# Altium project TK90X.PrjPcb
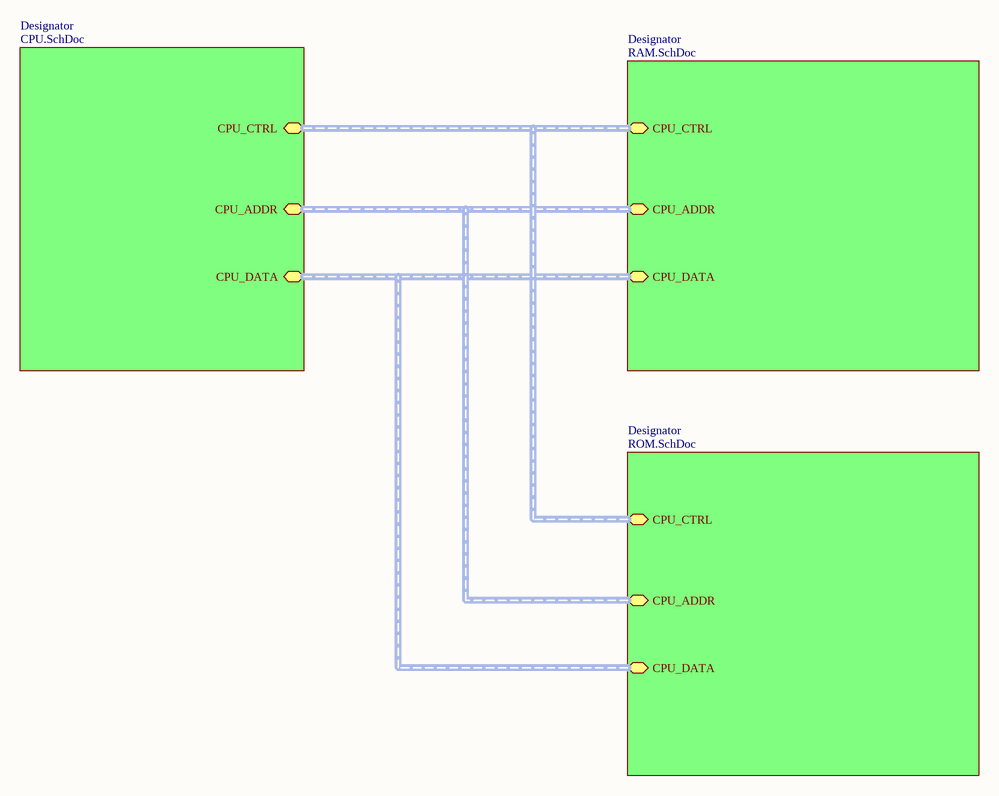
[diagram p0: TK90X.SchDoc]
8 sheets, 78 parts. Net scope: hierarchical (ports join the sheet entries above them; power ports are global).
Sheets:
  TK90X.SchDoc
    Designator = CPU.SchDoc
    Designator = RAM.SchDoc
    Designator = ROM.SchDoc
  ULA.SchDoc
  VRAM.SchDoc
  Power.SchDoc
  VGA.SchDoc

## Sheet TK90X.SchDoc
size A3

### Sub-sheets
Designator = CPU.SchDoc: CPU_CTRL (harness CPU_CTRL), CPU_ADDR (harness CPU_ADDR), CPU_DATA (harness CPU_DATA)
Designator = RAM.SchDoc: CPU_CTRL (harness CPU_CTRL), CPU_ADDR (harness CPU_ADDR), CPU_DATA (harness CPU_DATA)
Designator = ROM.SchDoc: CPU_CTRL (harness CPU_CTRL), CPU_ADDR (harness CPU_ADDR), CPU_DATA (harness CPU_DATA)

## Sheet CPU.SchDoc
size A3; PageSetup: Record=PageOptions|CenterHorizontal=True|CenterVertical=True|PrintScale=1.04|XCorrection=1.00|YCorrection=1.00|PrintKind=0|BorderSize=5000000|LeftOffset=0|BottomOffset=0|Orientation=2|PaperLength=1000|PaperWidth=1000|Scale=100|PaperSource=7|PrintQuality=-3|MediaType=1|DitherType=10|PrintScaleMode=1|PaperKind=A3|PaperIndex=8
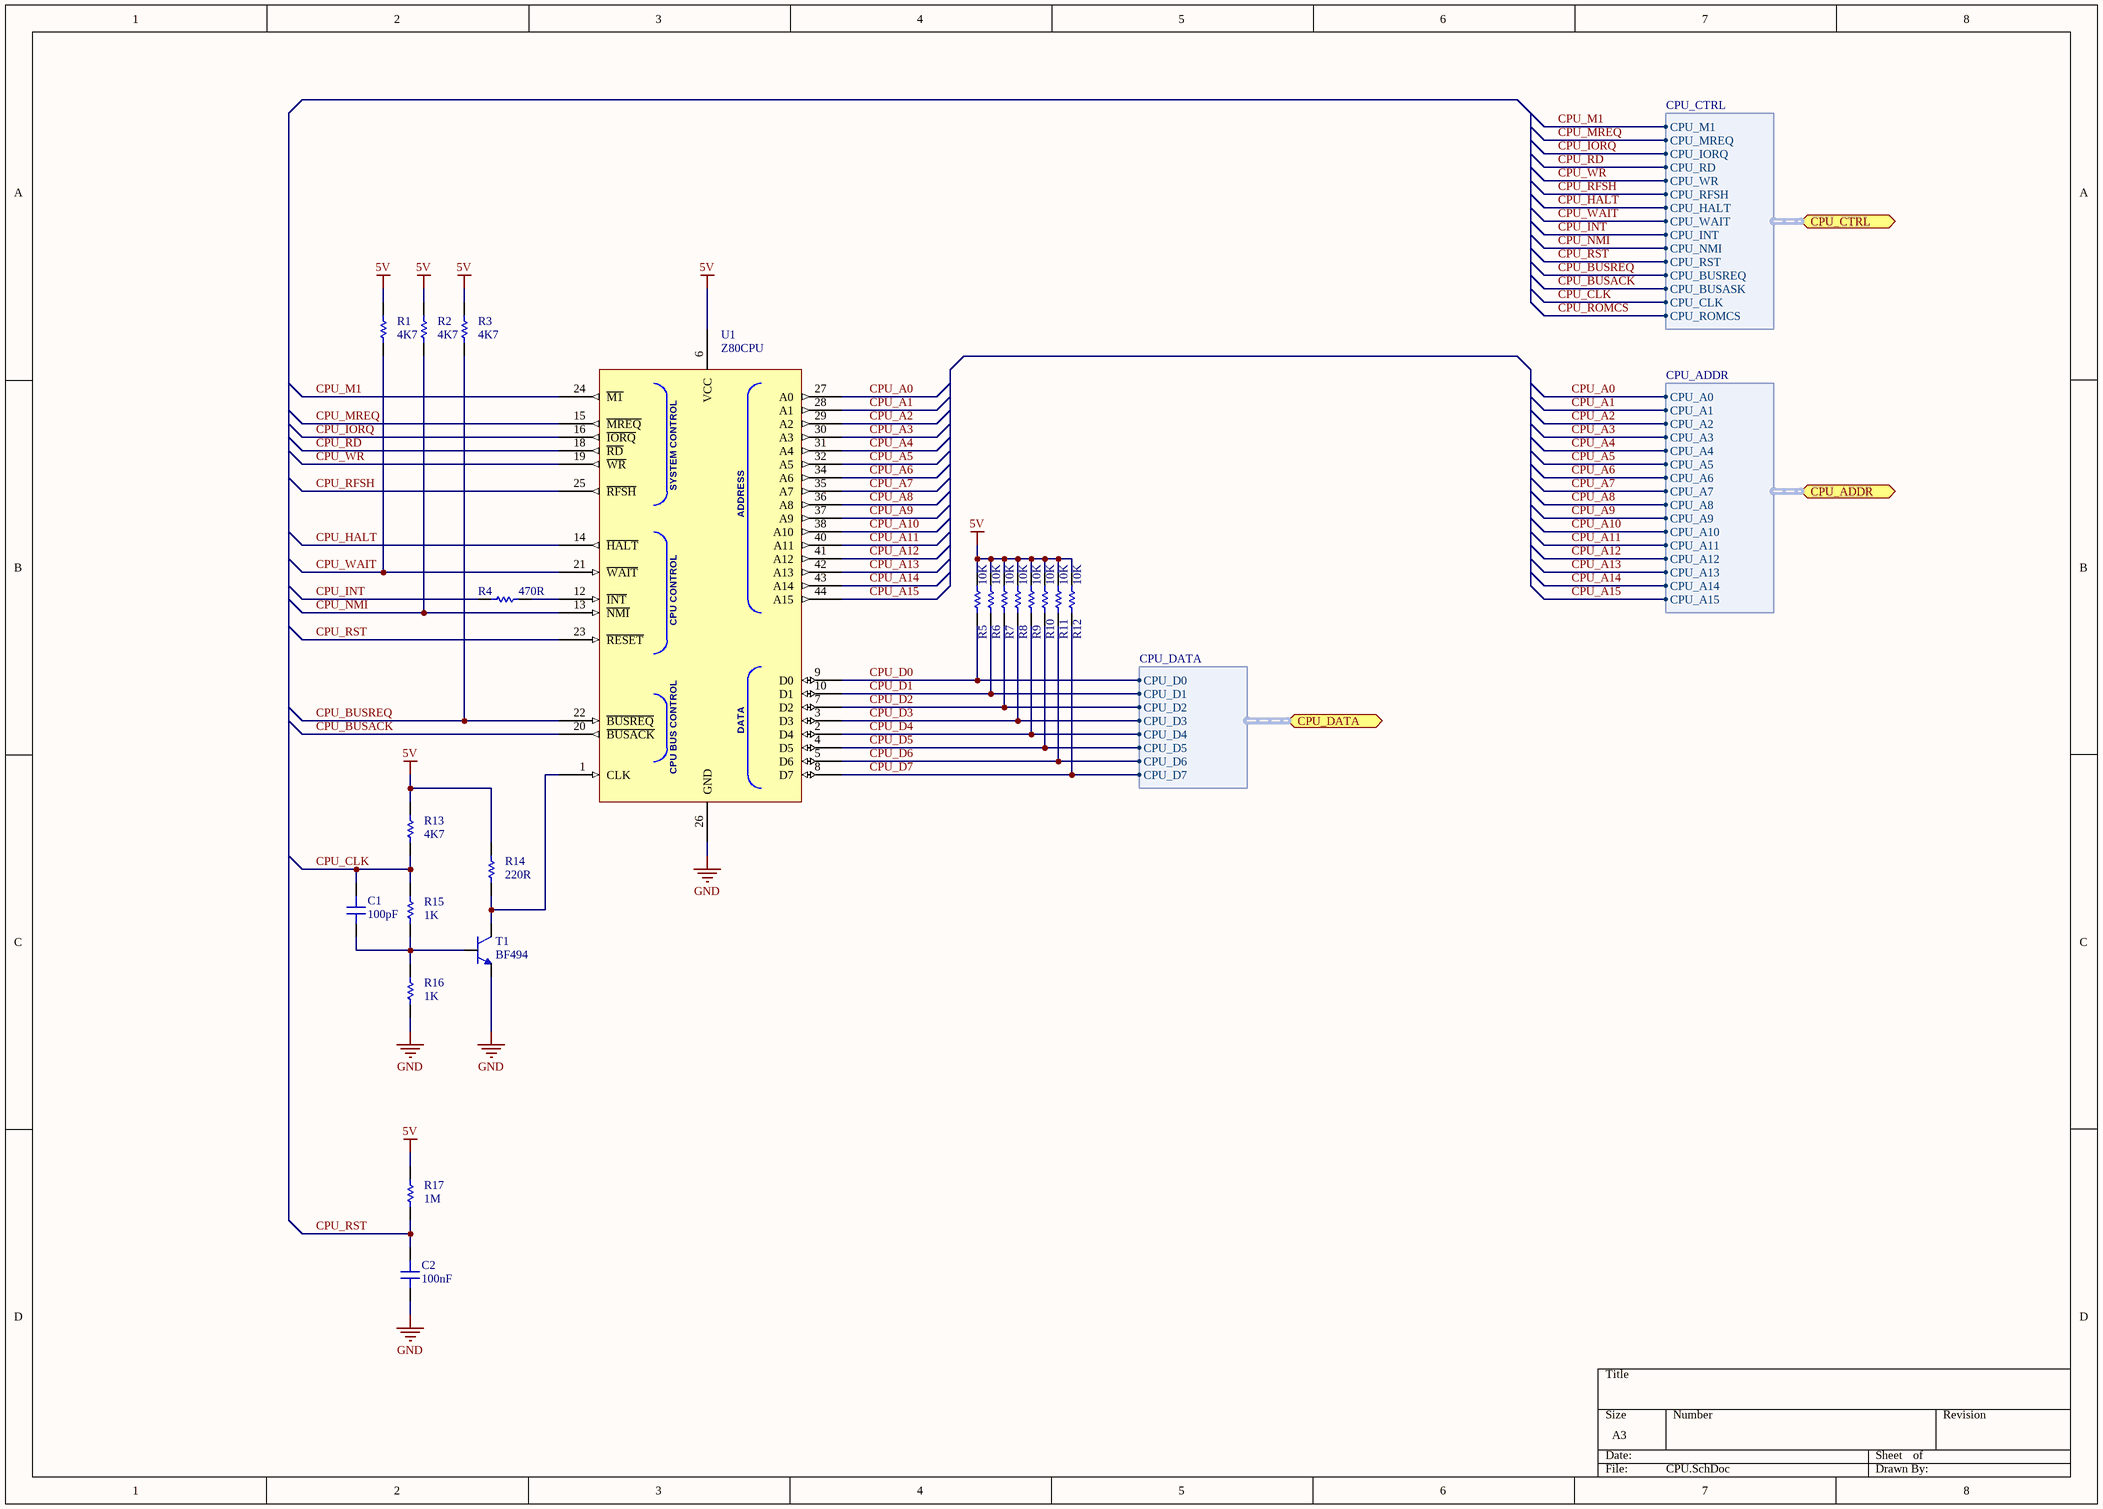
[diagram p1: CPU.SchDoc]

### Parts
C1  100pF  [0805]
C2  100nF  [0805]
R1  4K7  [0805]
R2  4K7  [0805]
R3  4K7  [0805]
R4  470R  [0805]
R5  10K  [0805]
R6  10K  [0805]
R7  10K  [0805]
R8  10K  [0805]
R9  10K  [0805]
R10  10K  [0805]
R11  10K  [0805]
R12  10K  [0805]
R13  4K7  [0805]
R14  220R  [0805]
R15  1K  [0805]
R16  1K  [0805]
R17  1M  [0805]
T1  BF494  [TO-92]
U1  Z80CPU  [Z84C00XXAEG]

### Ports
CPU_ADDR (harness CPU_ADDR), CPU_CTRL (harness CPU_CTRL), CPU_DATA (harness CPU_DATA)

### Harnesses
CPU_DATA: CPU_D0, CPU_D1, CPU_D2, CPU_D3, CPU_D4, CPU_D5, CPU_D6, CPU_D7
CPU_ADDR: CPU_A0, CPU_A1, CPU_A2, CPU_A3, CPU_A4, CPU_A5, CPU_A6, CPU_A7, CPU_A8, CPU_A9, CPU_A10, CPU_A11, CPU_A12, CPU_A13, CPU_A14, CPU_A15
CPU_CTRL: CPU_M1, CPU_MREQ, CPU_IORQ, CPU_RD, CPU_WR, CPU_RFSH, CPU_HALT, CPU_WAIT, CPU_INT, CPU_NMI, CPU_RST, CPU_BUSREQ, CPU_BUSASK, CPU_CLK, CPU_ROMCS

### Nets
5V: R1.2 R2.2 R3.2 R5.2 R6.2 R7.2 R8.2 R9.2 R10.2 R11.2 R12.2 R13.2 R14.2 R17.2 U1.6(VCC)
GND: C2.1 R16.1 T1.2 U1.26(GND)
CPU_A0: U1.27(A0) ; port CPU_ADDR.CPU_A0
CPU_A1: U1.28(A1) ; port CPU_ADDR.CPU_A1
CPU_A2: U1.29(A2) ; port CPU_ADDR.CPU_A2
CPU_A3: U1.30(A3) ; port CPU_ADDR.CPU_A3
CPU_A4: U1.31(A4) ; port CPU_ADDR.CPU_A4
CPU_A5: U1.32(A5) ; port CPU_ADDR.CPU_A5
CPU_A6: U1.34(A6) ; port CPU_ADDR.CPU_A6
CPU_A7: U1.35(A7) ; port CPU_ADDR.CPU_A7
CPU_A8: U1.36(A8) ; port CPU_ADDR.CPU_A8
CPU_A9: U1.37(A9) ; port CPU_ADDR.CPU_A9
CPU_A10: U1.38(A10) ; port CPU_ADDR.CPU_A10
CPU_A11: U1.40(A11) ; port CPU_ADDR.CPU_A11
CPU_A12: U1.41(A12) ; port CPU_ADDR.CPU_A12
CPU_A13: U1.42(A13) ; port CPU_ADDR.CPU_A13
CPU_A14: U1.43(A14) ; port CPU_ADDR.CPU_A14
CPU_A15: U1.44(A15) ; port CPU_ADDR.CPU_A15
CPU_BUSACK: U1.20(~{BUSACK}) ; port CPU_CTRL.CPU_BUSASK
CPU_BUSREQ: R3.1 U1.22(~{BUSREQ}) ; port CPU_CTRL.CPU_BUSREQ
CPU_CLK: C1.2 R13.1 R15.2 ; port CPU_CTRL.CPU_CLK
CPU_D0: R5.1 U1.9(D0) ; port CPU_DATA.CPU_D0
CPU_D1: R6.1 U1.10(D1) ; port CPU_DATA.CPU_D1
CPU_D2: R7.1 U1.7(D2) ; port CPU_DATA.CPU_D2
CPU_D3: R8.1 U1.3(D3) ; port CPU_DATA.CPU_D3
CPU_D4: R9.1 U1.2(D4) ; port CPU_DATA.CPU_D4
CPU_D5: R10.1 U1.4(D5) ; port CPU_DATA.CPU_D5
CPU_D6: R11.1 U1.5(D6) ; port CPU_DATA.CPU_D6
CPU_D7: R12.1 U1.8(D7) ; port CPU_DATA.CPU_D7
CPU_HALT: U1.14(~{HALT}) ; port CPU_CTRL.CPU_HALT
CPU_INT: R4.1 ; port CPU_CTRL.CPU_INT
CPU_IORQ: U1.16(~{IORQ}) ; port CPU_CTRL.CPU_IORQ
CPU_M1: U1.24(~{M1}) ; port CPU_CTRL.CPU_M1
CPU_MREQ: U1.15(~{MREQ}) ; port CPU_CTRL.CPU_MREQ
CPU_NMI: R2.1 U1.13(~{NMI}) ; port CPU_CTRL.CPU_NMI
CPU_RD: U1.18(~{RD}) ; port CPU_CTRL.CPU_RD
CPU_RFSH: U1.25(~{RFSH}) ; port CPU_CTRL.CPU_RFSH
CPU_RST: C2.2 R17.1 U1.23(~{RESET}) ; port CPU_CTRL.CPU_RST
CPU_WAIT: R1.1 U1.21(~{WAIT}) ; port CPU_CTRL.CPU_WAIT
CPU_WR: U1.19(~{WR}) ; port CPU_CTRL.CPU_WR
NetC1_1: C1.1 R15.1 R16.2 T1.1
NetR4_2: R4.2 U1.12(~{INT})
NetR14_1: R14.1 T1.3 U1.1(CLK)

Not connected (* = marked no-connect by the designer): U1 11(NC_0) 17(NC_1) 33(NC_2) 39(NC_3)

### Notes on the sheet
- (in symbol Z84C00xxAEG) SYSTEM CONTROL; ADDRESS; CPU CONTROL; DATA; CPU BUS CONTROL

### Library data of the parts
C1 C2 = Capacitor
R1-R17 = Resistor
T1 = BF494: NPN Medium Frequency Transistors
U1 = Z84C00xxAEG: Z80 - CPU

## Sheet RAM.SchDoc
size A3; PageSetup: Record=PageOptions|CenterHorizontal=True|CenterVertical=True|PrintScale=0.73|XCorrection=1.00|YCorrection=1.00|PrintKind=0|BorderSize=5000000|LeftOffset=0|BottomOffset=0|Orientation=2|PaperLength=1000|PaperWidth=1000|Scale=100|PaperSource=7|PrintQuality=-3|MediaType=1|DitherType=10|PrintScaleMode=1|PaperKind=A4|PaperIndex=9
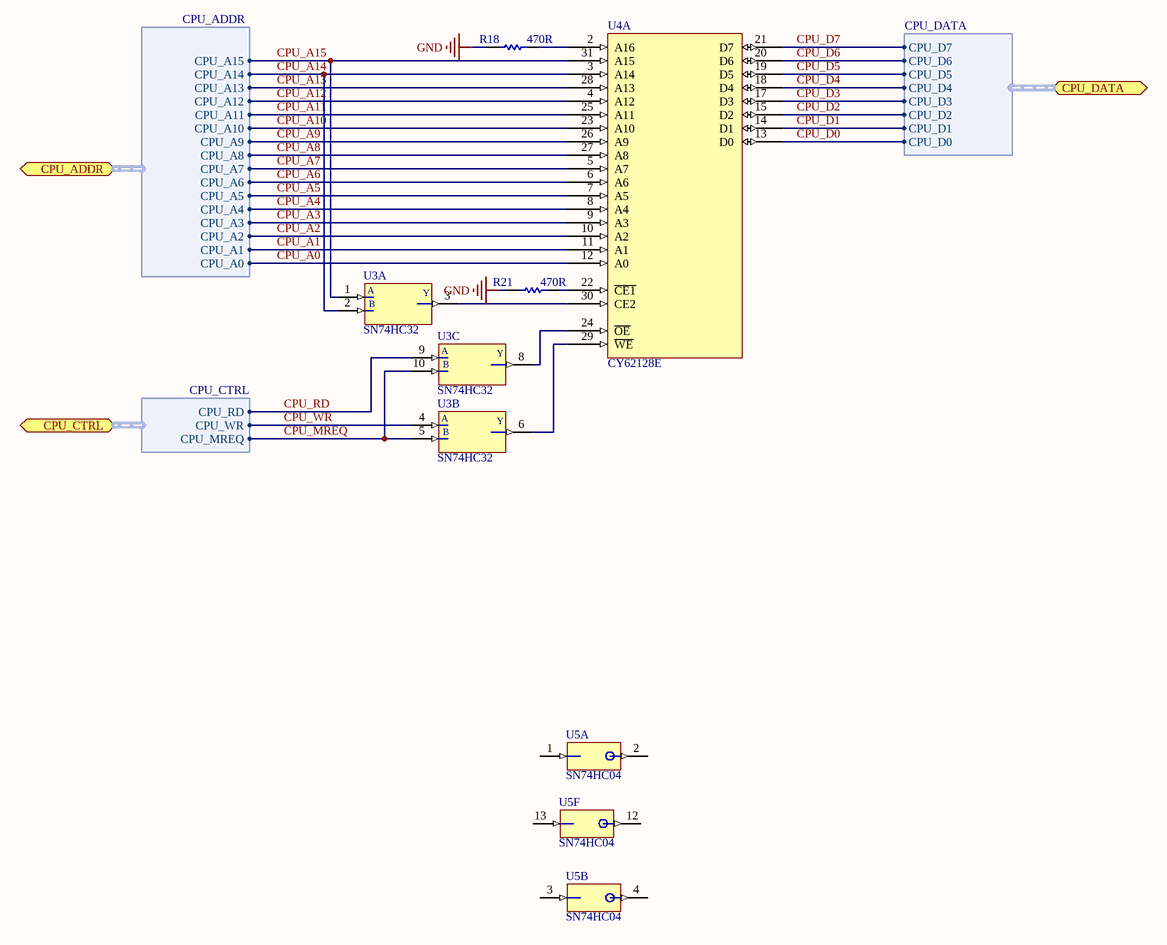
[diagram p2: RAM.SchDoc]

### Parts
R18  470R  [0805]
R21  470R  [0805]
U3  SN74HC32  [SOIC14]  (parts A,B,C of 5)
U4  CY62128E  [CY62128E-SOIC]  (part A of 2)
U5  SN74HC04  [SOIC14]  (parts A,B,F of 7)

### Ports
CPU_ADDR (harness CPU_ADDR), CPU_CTRL (harness CPU_CTRL), CPU_DATA (harness CPU_DATA)

### Harnesses
CPU_ADDR: CPU_A0, CPU_A1, CPU_A2, CPU_A3, CPU_A4, CPU_A5, CPU_A6, CPU_A7, CPU_A8, CPU_A9, CPU_A10, CPU_A11, CPU_A12, CPU_A13, CPU_A14, CPU_A15
CPU_CTRL: CPU_MREQ, CPU_RD, CPU_WR
CPU_DATA: CPU_D0, CPU_D1, CPU_D2, CPU_D3, CPU_D4, CPU_D5, CPU_D6, CPU_D7

### Nets
GND: R18.2 R21.2
CPU_A0: U4.12(A0) ; port CPU_ADDR.CPU_A0
CPU_A1: U4.11(A1) ; port CPU_ADDR.CPU_A1
CPU_A2: U4.10(A2) ; port CPU_ADDR.CPU_A2
CPU_A3: U4.9(A3) ; port CPU_ADDR.CPU_A3
CPU_A4: U4.8(A4) ; port CPU_ADDR.CPU_A4
CPU_A5: U4.7(A5) ; port CPU_ADDR.CPU_A5
CPU_A6: U4.6(A6) ; port CPU_ADDR.CPU_A6
CPU_A7: U4.5(A7) ; port CPU_ADDR.CPU_A7
CPU_A8: U4.27(A8) ; port CPU_ADDR.CPU_A8
CPU_A9: U4.26(A9) ; port CPU_ADDR.CPU_A9
CPU_A10: U4.23(A10) ; port CPU_ADDR.CPU_A10
CPU_A11: U4.25(A11) ; port CPU_ADDR.CPU_A11
CPU_A12: U4.4(A12) ; port CPU_ADDR.CPU_A12
CPU_A13: U4.28(A13) ; port CPU_ADDR.CPU_A13
CPU_A14: U3.2(B) U4.3(A14) ; port CPU_ADDR.CPU_A14
CPU_A15: U3.1(A) U4.31(A15) ; port CPU_ADDR.CPU_A15
CPU_D0: U4.13(D0) ; port CPU_DATA.CPU_D0
CPU_D1: U4.14(D1) ; port CPU_DATA.CPU_D1
CPU_D2: U4.15(D2) ; port CPU_DATA.CPU_D2
CPU_D3: U4.17(D3) ; port CPU_DATA.CPU_D3
CPU_D4: U4.18(D4) ; port CPU_DATA.CPU_D4
CPU_D5: U4.19(D5) ; port CPU_DATA.CPU_D5
CPU_D6: U4.20(D6) ; port CPU_DATA.CPU_D6
CPU_D7: U4.21(D7) ; port CPU_DATA.CPU_D7
CPU_MREQ: U3.5(B) U3.10(B) ; port CPU_CTRL.CPU_MREQ
CPU_RD: U3.9(A) ; port CPU_CTRL.CPU_RD
CPU_WR: U3.4(A) ; port CPU_CTRL.CPU_WR
NetR18_1: R18.1 U4.2(A16)
NetR21_1: R21.1 U4.22(~{CE1})
NetU3_3: U3.3(Y) U4.30(CE2)
NetU3_6: U3.6(Y) U4.29(~{WE})
NetU3_8: U3.8(Y) U4.24(~{OE})

Not connected (* = marked no-connect by the designer): U5 1(A) 2(Y) 3(A) 4(Y) 12(Y) 13(A)

### Library data of the parts
R18 R21 = Resistor
U3 = SN74HC32: Quadruple 2-Input Positive-OR Gates
U4 = CY62128E: 128KB Static RAM
U5 = SN74HC04: Hex Inverters

## Sheet ROM.SchDoc
size A3; PageSetup: Record=PageOptions|CenterHorizontal=True|CenterVertical=True|PrintScale=0.73|XCorrection=1.00|YCorrection=1.00|PrintKind=0|BorderSize=5000000|LeftOffset=0|BottomOffset=0|Orientation=2|PaperLength=1000|PaperWidth=1000|Scale=100|PaperSource=7|PrintQuality=-3|MediaType=1|DitherType=10|PrintScaleMode=1|PaperKind=A4|PaperIndex=9
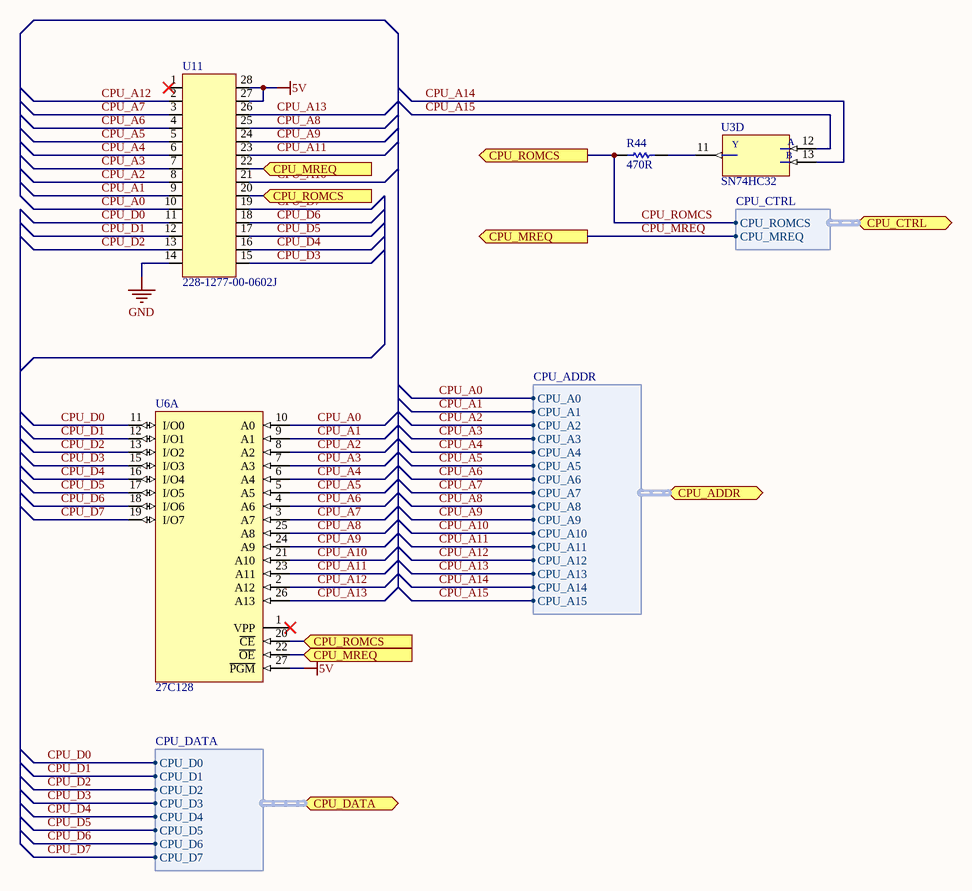
[diagram p3: ROM.SchDoc]

### Parts
R44  470R  [0805]
U3  SN74HC32  [SOIC14]  (part D of 5)
U6  27C128  [PDIP28]  (part A of 2)
U11  228-1277-00-0602J  [228-1277-00-0602J]

### Ports
CPU_ADDR (harness CPU_ADDR), CPU_CTRL (harness CPU_CTRL), CPU_DATA (harness CPU_DATA), CPU_MREQ (in), CPU_MREQ (out), CPU_ROMCS (in), CPU_ROMCS (out)

### Harnesses
CPU_DATA: CPU_D0, CPU_D1, CPU_D2, CPU_D3, CPU_D4, CPU_D5, CPU_D6, CPU_D7
CPU_ADDR: CPU_A0, CPU_A1, CPU_A2, CPU_A3, CPU_A4, CPU_A5, CPU_A6, CPU_A7, CPU_A8, CPU_A9, CPU_A10, CPU_A11, CPU_A12, CPU_A13, CPU_A14, CPU_A15
CPU_CTRL: CPU_MREQ, CPU_ROMCS

### Nets
5V: U6.27(~{PGM}) U11.27 U11.28
GND: U11.14
CPU_A0: U6.10(A0) U11.10 ; port CPU_ADDR.CPU_A0
CPU_A1: U6.9(A1) U11.9 ; port CPU_ADDR.CPU_A1
CPU_A2: U6.8(A2) U11.8 ; port CPU_ADDR.CPU_A2
CPU_A3: U6.7(A3) U11.7 ; port CPU_ADDR.CPU_A3
CPU_A4: U6.6(A4) U11.6 ; port CPU_ADDR.CPU_A4
CPU_A5: U6.5(A5) U11.5 ; port CPU_ADDR.CPU_A5
CPU_A6: U6.4(A6) U11.4 ; port CPU_ADDR.CPU_A6
CPU_A7: U6.3(A7) U11.3 ; port CPU_ADDR.CPU_A7
CPU_A8: U6.25(A8) U11.25 ; port CPU_ADDR.CPU_A8
CPU_A9: U6.24(A9) U11.24 ; port CPU_ADDR.CPU_A9
CPU_A10: U6.21(A10) U11.21 ; port CPU_ADDR.CPU_A10
CPU_A11: U6.23(A11) U11.23 ; port CPU_ADDR.CPU_A11
CPU_A12: U6.2(A12) U11.2 ; port CPU_ADDR.CPU_A12
CPU_A13: U6.26(A13) U11.26 ; port CPU_ADDR.CPU_A13
CPU_A14: U3.13(B) ; port CPU_ADDR.CPU_A14
CPU_A15: U3.12(A) ; port CPU_ADDR.CPU_A15
CPU_D0: U6.11(I/O0) U11.11 ; port CPU_DATA.CPU_D0
CPU_D1: U6.12(I/O1) U11.12 ; port CPU_DATA.CPU_D1
CPU_D2: U6.13(I/O2) U11.13 ; port CPU_DATA.CPU_D2
CPU_D3: U6.15(I/O3) U11.15 ; port CPU_DATA.CPU_D3
CPU_D4: U6.16(I/O4) U11.16 ; port CPU_DATA.CPU_D4
CPU_D5: U6.17(I/O5) U11.17 ; port CPU_DATA.CPU_D5
CPU_D6: U6.18(I/O6) U11.18 ; port CPU_DATA.CPU_D6
CPU_D7: U6.19(I/O7) U11.19 ; port CPU_DATA.CPU_D7
CPU_MREQ: U6.22(~{OE}) U11.22 ; port CPU_MREQ, port CPU_CTRL.CPU_MREQ
CPU_ROMCS: R44.2 U6.20(~{CE}) U11.20 ; port CPU_ROMCS, port CPU_CTRL.CPU_ROMCS
NetR44_1: R44.1 U3.11(Y)

Not connected (* = marked no-connect by the designer): U6 1(VPP)*; U11 1*

### Library data of the parts
R44 = Resistor
U3 = SN74HC32: Quadruple 2-Input Positive-OR Gates
U6 = 27C128: 128K (16K x 8) CMOS EPROM
U11 = 228-1277-00-0602J: DIP Sockets - 28 Pins

## Sheet ULA.SchDoc
size A3
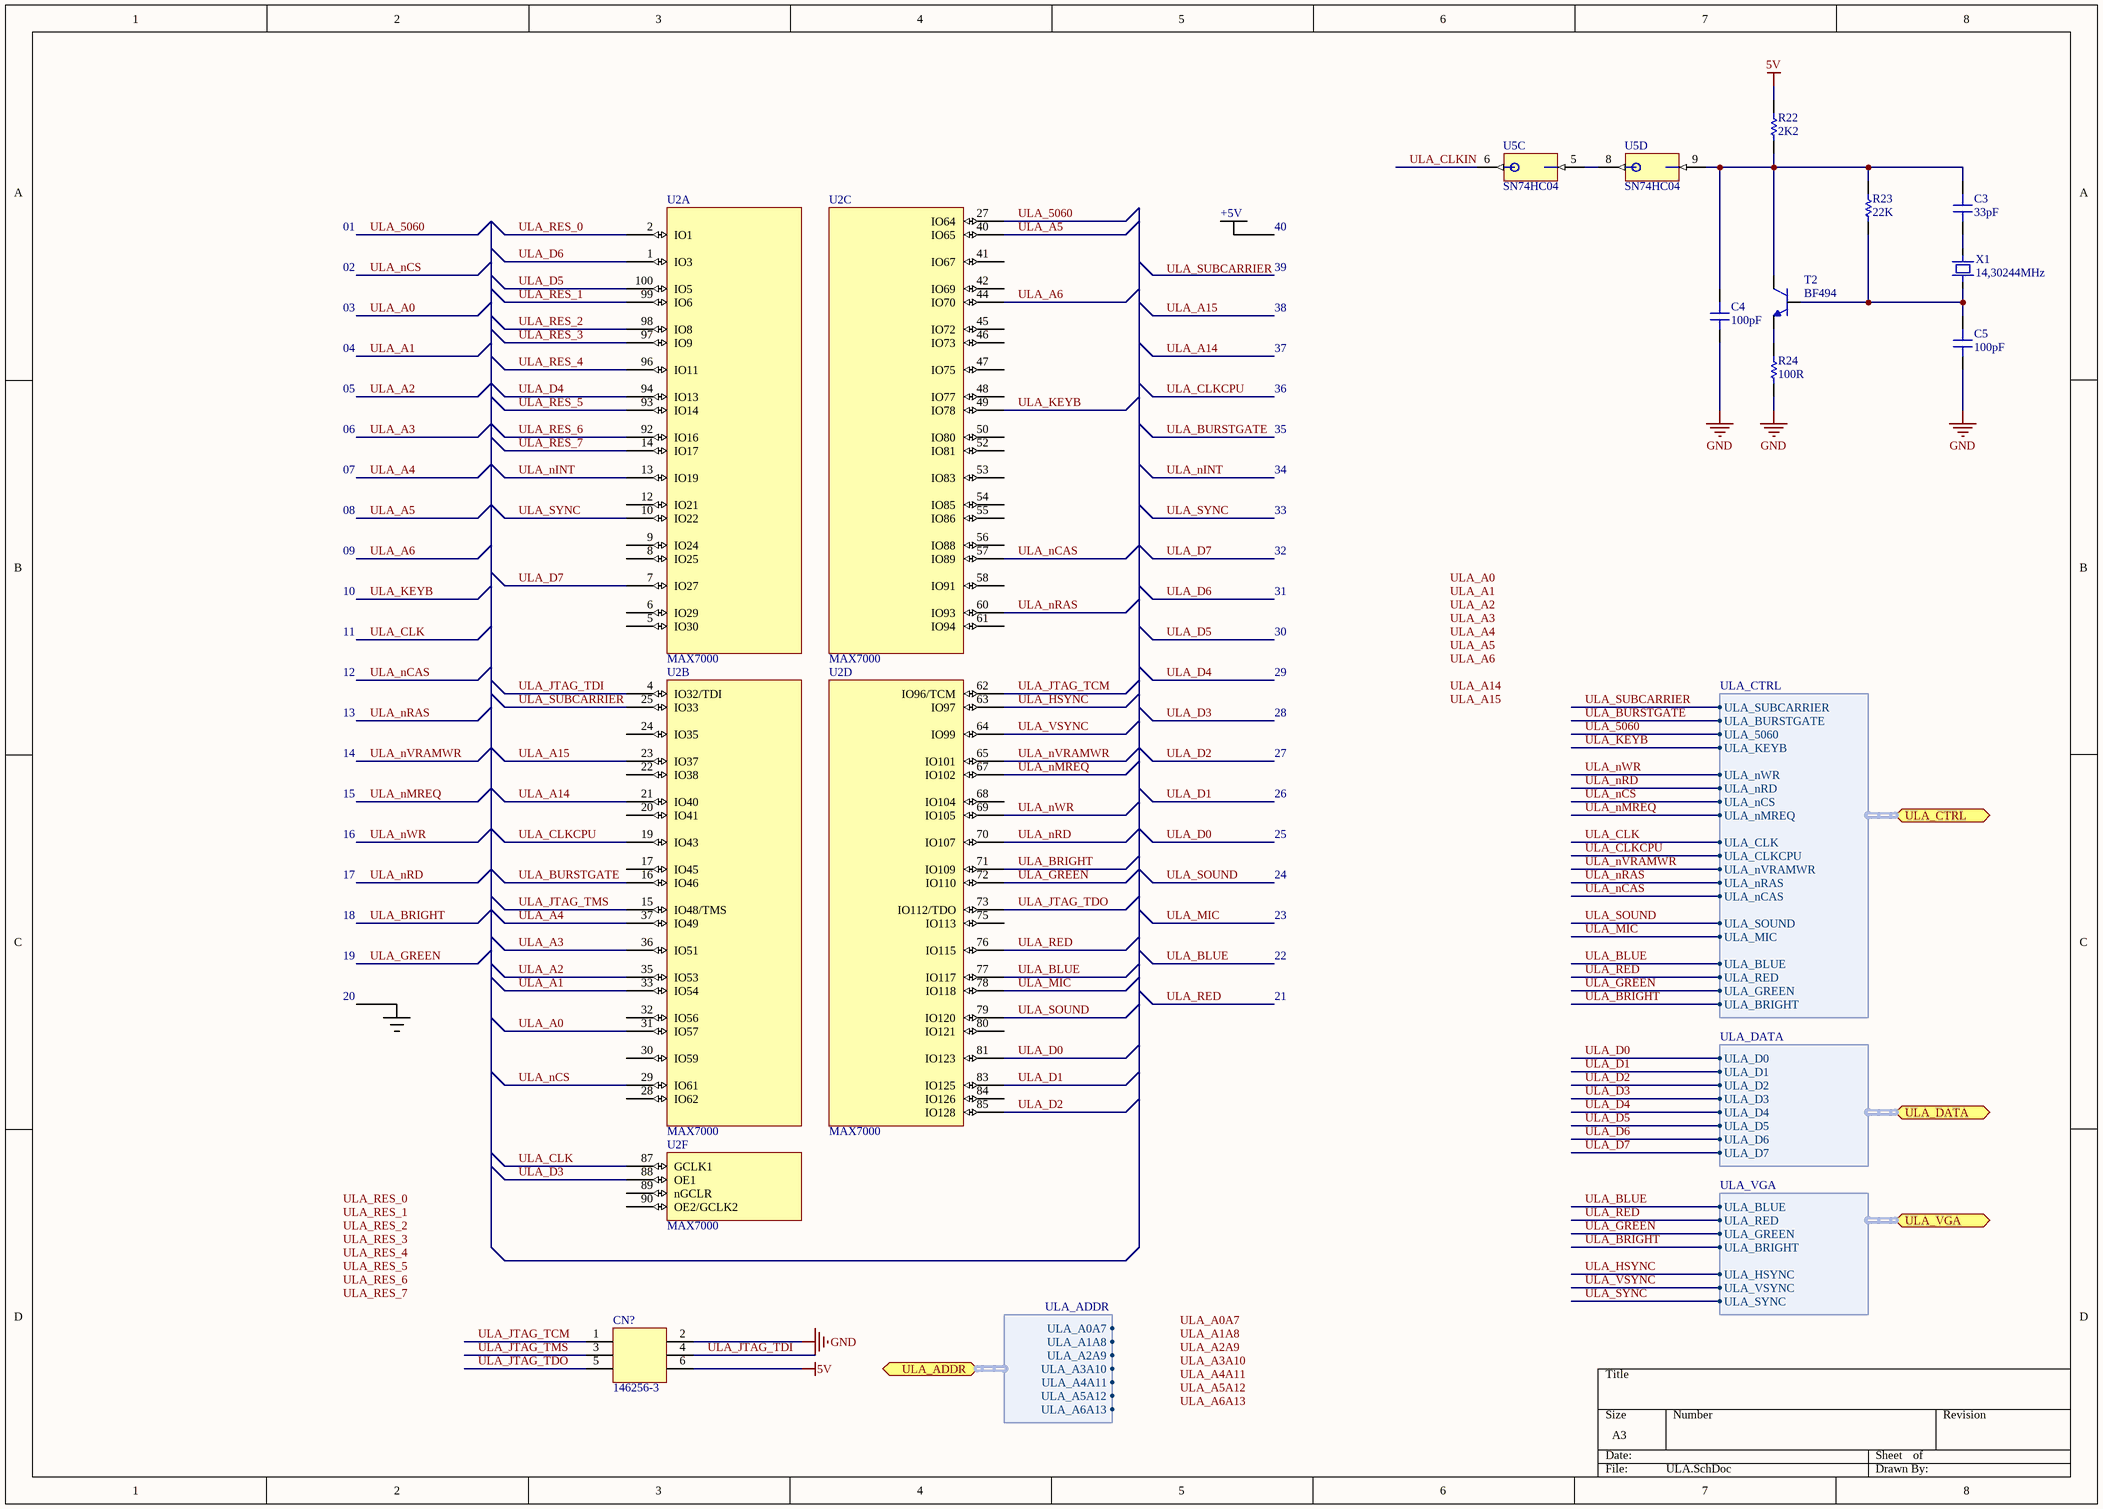
[diagram p4: ULA.SchDoc]

### Parts
(Parts that share a designator on the sheet are numbered #1, #2 ... from top to bottom, then left to right.)
C3  33pF  [0805]
C4  100pF  [0805]
C5  100pF  [0805]
CN?#1  146256-3  [146256-3]
R22  2K2  [0805]
R23  22K  [0805]
R24  100R  [0805]
T2  BF494  [TO-92]
U2  MAX7000  [TQFP100]  (parts A,B,C,D,F of 6)
U5  SN74HC04  [SOIC14]  (parts C,D of 7)
X1  14,30244MHz  [HC49S]

### Ports
ULA_ADDR (harness ULA_ADDR), ULA_CTRL (harness ULA_CTRL), ULA_DATA (harness ULA_DATA), ULA_VGA (harness ULA_VGA)

### Harnesses
ULA_CTRL: ULA_BURSTGATE, ULA_5060, ULA_KEYB, ULA_nWR, ULA_nRD, ULA_nCS, ULA_SUBCARRIER, ULA_nMREQ, ULA_CLK, ULA_CLKCPU, ULA_nVRAMWR, ULA_nRAS, ULA_nCAS, ULA_SOUND, ULA_MIC, ULA_BLUE, ULA_RED, ULA_GREEN, ULA_BRIGHT
ULA_ADDR: ULA_A0A7, ULA_A1A8, ULA_A2A9, ULA_A3A10, ULA_A4A11, ULA_A5A12, ULA_A6A13
ULA_DATA: ULA_D0, ULA_D1, ULA_D2, ULA_D3, ULA_D4, ULA_D5, ULA_D6, ULA_D7
ULA_VGA: ULA_BLUE, ULA_RED, ULA_GREEN, ULA_BRIGHT, ULA_HSYNC, ULA_VSYNC, ULA_SYNC

### Nets
5V: CN?#1.6 R22.2
GND: C4.1 C5.1 CN?#1.2 R24.1
ULA_5060: U2.27(IO64) ; port ULA_CTRL.ULA_5060
ULA_A0: U2.31(IO57)
ULA_A1: U2.33(IO54)
ULA_A2: U2.35(IO53)
ULA_A3: U2.36(IO51)
ULA_A4: U2.37(IO49)
ULA_A5: U2.40(IO65)
ULA_A6: U2.44(IO70)
ULA_A14: U2.21(IO40)
ULA_A15: U2.23(IO37)
ULA_BLUE: U2.77(IO117) ; port ULA_CTRL.ULA_BLUE, port ULA_VGA.ULA_BLUE
ULA_BRIGHT: U2.71(IO109) ; port ULA_CTRL.ULA_BRIGHT, port ULA_VGA.ULA_BRIGHT
ULA_BURSTGATE: U2.16(IO46) ; port ULA_CTRL.ULA_BURSTGATE
ULA_CLK: U2.87(GCLK1) ; port ULA_CTRL.ULA_CLK
ULA_CLKCPU: U2.19(IO43) ; port ULA_CTRL.ULA_CLKCPU
ULA_CLKIN: U5.6(Y)
ULA_D0: U2.81(IO123) ; port ULA_DATA.ULA_D0
ULA_D1: U2.83(IO125) ; port ULA_DATA.ULA_D1
ULA_D2: U2.85(IO128) ; port ULA_DATA.ULA_D2
ULA_D3: U2.88(OE1) ; port ULA_DATA.ULA_D3
ULA_D4: U2.94(IO13) ; port ULA_DATA.ULA_D4
ULA_D5: U2.100(IO5) ; port ULA_DATA.ULA_D5
ULA_D6: U2.1(IO3) ; port ULA_DATA.ULA_D6
ULA_D7: U2.7(IO27) ; port ULA_DATA.ULA_D7
ULA_GREEN: U2.72(IO110) ; port ULA_CTRL.ULA_GREEN, port ULA_VGA.ULA_GREEN
ULA_HSYNC: U2.63(IO97) ; port ULA_VGA.ULA_HSYNC
ULA_JTAG_TCM: CN?#1.1 U2.62(IO96/TCM)
ULA_JTAG_TDI: CN?#1.4 U2.4(IO32/TDI)
ULA_JTAG_TDO: CN?#1.5 U2.73(IO112/TDO)
ULA_JTAG_TMS: CN?#1.3 U2.15(IO48/TMS)
ULA_KEYB: U2.49(IO78) ; port ULA_CTRL.ULA_KEYB
ULA_MIC: U2.78(IO118) ; port ULA_CTRL.ULA_MIC
ULA_nCAS: U2.57(IO89) ; port ULA_CTRL.ULA_nCAS
ULA_nCS: U2.29(IO61) ; port ULA_CTRL.ULA_nCS
ULA_nINT: U2.13(IO19)
ULA_nMREQ: U2.67(IO102) ; port ULA_CTRL.ULA_nMREQ
ULA_nRAS: U2.60(IO93) ; port ULA_CTRL.ULA_nRAS
ULA_nRD: U2.70(IO107) ; port ULA_CTRL.ULA_nRD
ULA_nVRAMWR: U2.65(IO101) ; port ULA_CTRL.ULA_nVRAMWR
ULA_nWR: U2.69(IO105) ; port ULA_CTRL.ULA_nWR
ULA_RED: U2.76(IO115) ; port ULA_CTRL.ULA_RED, port ULA_VGA.ULA_RED
ULA_RES_0: U2.2(IO1)
ULA_RES_1: U2.99(IO6)
ULA_RES_2: U2.98(IO8)
ULA_RES_3: U2.97(IO9)
ULA_RES_4: U2.96(IO11)
ULA_RES_5: U2.93(IO14)
ULA_RES_6: U2.92(IO16)
ULA_RES_7: U2.14(IO17)
ULA_SOUND: U2.79(IO120) ; port ULA_CTRL.ULA_SOUND
ULA_SUBCARRIER: U2.25(IO33) ; port ULA_CTRL.ULA_SUBCARRIER
ULA_SYNC: U2.10(IO22) ; port ULA_VGA.ULA_SYNC
ULA_VSYNC: U2.64(IO99) ; port ULA_VGA.ULA_VSYNC
NetC3_1: C3.1 X1.2
NetC3_2: C3.2 C4.2 R22.1 R23.2 T2.3 U5.9(A)
NetC5_2: C5.2 R23.1 T2.1 X1.1
NetR24_2: R24.2 T2.2
NetU5_5: U5.5(A) U5.8(Y)

Not connected (* = marked no-connect by the designer): U2 5(IO30) 6(IO29) 8(IO25) 9(IO24) 12(IO21) 17(IO45) 20(IO41) 22(IO38) 24(IO35) 28(IO62) 30(IO59) 32(IO56) 41(IO67) 42(IO69) 45(IO72) 46(IO73) 47(IO75) 48(IO77) 50(IO80) 52(IO81) 53(IO83) 54(IO85) 55(IO86) 56(IO88) 58(IO91) 61(IO94) 68(IO104) 75(IO113) 80(IO121) 84(IO126) 89(nGCLR) 90(OE2/GCLK2)

### Notes on the sheet
- 01
- +5V
- 40
- 02
- 03
- 38
- 39
- 04
- 37
- 05
- 06
- 35
- 36
- 07
- 08
- 33
- 34
- 09
- 32
- 10
- 11
- 30
- 31
- 12
- 13
- 28
- 29
- 14
- 27
- 15
- 16
- 25
- 26
- 17
- 18
- 23
- 24
- 19
- 22
- 20
- 21
- Labels drawn without touching a wire or pin: ULA_A0, ULA_A0A7, ULA_A1, ULA_A1A8, ULA_A2, ULA_A2A9, ULA_A3, ULA_A3A10, ULA_A4, ULA_A4A11, ULA_A5, ULA_A5A12, ULA_A6, ULA_A6A13, ULA_A14, ULA_A15, ULA_RES_0, ULA_RES_1, ULA_RES_2, ULA_RES_3, ULA_RES_4, ULA_RES_5, ULA_RES_6, ULA_RES_7, ULA_SUBCARRIER

### Library data of the parts
C3-C5 = Capacitor
CN?#1 = 146256-3: CONN Header Breakaway
R22-R24 = Resistor
T2 = BF494: NPN Medium Frequency Transistors
U5 = SN74HC04: Hex Inverters
X1 = HC49S: Crystal HC49S

## Sheet VRAM.SchDoc
size A3
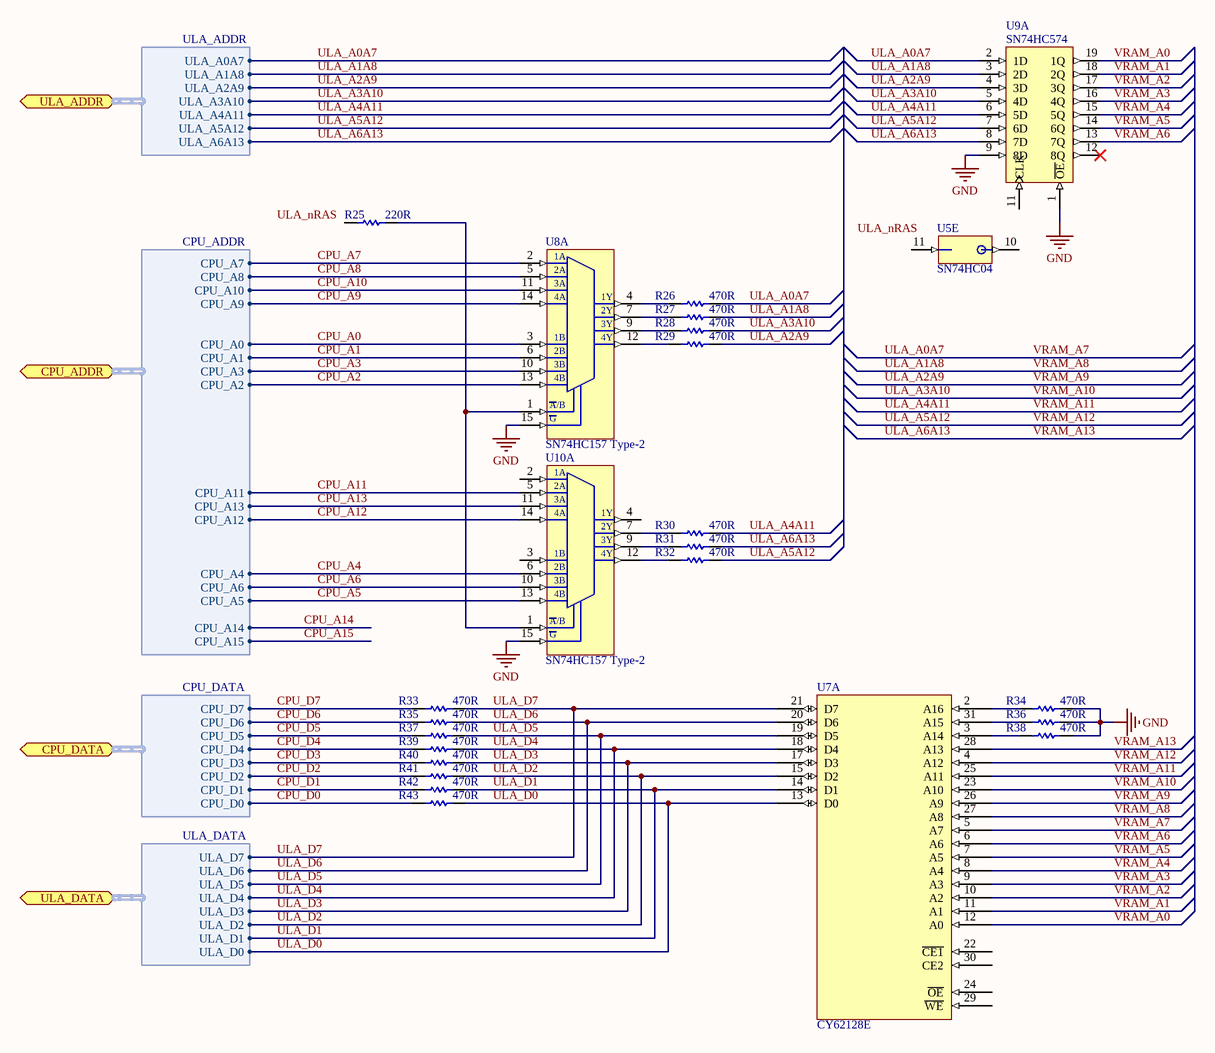
[diagram p5: VRAM.SchDoc]

### Parts
R25  220R  [0805]
R26  470R  [0805]
R27  470R  [0805]
R28  470R  [0805]
R29  470R  [0805]
R30  470R  [0805]
R31  470R  [0805]
R32  470R  [0805]
R33  470R  [0805]
R34  470R  [0805]
R35  470R  [0805]
R36  470R  [0805]
R37  470R  [0805]
R38  470R  [0805]
R39  470R  [0805]
R40  470R  [0805]
R41  470R  [0805]
R42  470R  [0805]
R43  470R  [0805]
U5  SN74HC04  [SOIC14]  (part E of 7)
U7  CY62128E  [CY62128E-SOIC]  (part A of 2)
U8  SN74HC157 Type-2  [TSSOP16]  (part A of 2)
U9  SN74HC574  [SOIC20]  (part A of 2)
U10  SN74HC157 Type-2  [TSSOP16]  (part A of 2)

### Ports
CPU_ADDR (harness CPU_ADDR), CPU_DATA (harness CPU_DATA), ULA_ADDR (harness ULA_ADDR), ULA_DATA (harness ULA_DATA)

### Harnesses
CPU_ADDR: CPU_A0, CPU_A1, CPU_A2, CPU_A3, CPU_A4, CPU_A5, CPU_A6, CPU_A7, CPU_A8, CPU_A9, CPU_A10, CPU_A11, CPU_A12, CPU_A13, CPU_A14, CPU_A15
CPU_DATA: CPU_D0, CPU_D1, CPU_D2, CPU_D3, CPU_D4, CPU_D5, CPU_D6, CPU_D7
ULA_ADDR: ULA_A0A7, ULA_A1A8, ULA_A2A9, ULA_A3A10, ULA_A4A11, ULA_A5A12, ULA_A6A13
ULA_DATA: ULA_D0, ULA_D1, ULA_D2, ULA_D3, ULA_D4, ULA_D5, ULA_D6, ULA_D7

### Nets
GND: R34.1 R36.1 R38.1 U8.15(G) U9.1(~{OE}) U9.9(8D) U10.15(G)
CPU_A0: U8.3(1B) ; port CPU_ADDR.CPU_A0
CPU_A1: U8.6(2B) ; port CPU_ADDR.CPU_A1
CPU_A2: U8.13(4B) ; port CPU_ADDR.CPU_A2
CPU_A3: U8.10(3B) ; port CPU_ADDR.CPU_A3
CPU_A4: U10.6(2B) ; port CPU_ADDR.CPU_A4
CPU_A5: U10.13(4B) ; port CPU_ADDR.CPU_A5
CPU_A6: U10.10(3B) ; port CPU_ADDR.CPU_A6
CPU_A7: U8.2(1A) ; port CPU_ADDR.CPU_A7
CPU_A8: U8.5(2A) ; port CPU_ADDR.CPU_A8
CPU_A9: U8.14(4A) ; port CPU_ADDR.CPU_A9
CPU_A10: U8.11(3A) ; port CPU_ADDR.CPU_A10
CPU_A11: U10.5(2A) ; port CPU_ADDR.CPU_A11
CPU_A12: U10.14(4A) ; port CPU_ADDR.CPU_A12
CPU_A13: U10.11(3A) ; port CPU_ADDR.CPU_A13
CPU_A14: port CPU_ADDR.CPU_A14
CPU_A15: port CPU_ADDR.CPU_A15
CPU_D0: R43.2 ; port CPU_DATA.CPU_D0
CPU_D1: R42.2 ; port CPU_DATA.CPU_D1
CPU_D2: R41.2 ; port CPU_DATA.CPU_D2
CPU_D3: R40.2 ; port CPU_DATA.CPU_D3
CPU_D4: R39.2 ; port CPU_DATA.CPU_D4
CPU_D5: R37.2 ; port CPU_DATA.CPU_D5
CPU_D6: R35.2 ; port CPU_DATA.CPU_D6
CPU_D7: R33.2 ; port CPU_DATA.CPU_D7
ULA_A0A7: R26.1 U7.5(A7) U9.2(1D) ; port ULA_ADDR.ULA_A0A7  [also labelled VRAM_A7]
ULA_A1A8: R27.1 U7.27(A8) U9.3(2D) ; port ULA_ADDR.ULA_A1A8  [also labelled VRAM_A8]
ULA_A2A9: R29.1 U7.26(A9) U9.4(3D) ; port ULA_ADDR.ULA_A2A9  [also labelled VRAM_A9]
ULA_A3A10: R28.1 U7.23(A10) U9.5(4D) ; port ULA_ADDR.ULA_A3A10  [also labelled VRAM_A10]
ULA_A4A11: R30.1 U7.25(A11) U9.6(5D) ; port ULA_ADDR.ULA_A4A11  [also labelled VRAM_A11]
ULA_A5A12: R32.1 U7.4(A12) U9.7(6D) ; port ULA_ADDR.ULA_A5A12  [also labelled VRAM_A12]
ULA_A6A13: R31.1 U7.28(A13) U9.8(7D) ; port ULA_ADDR.ULA_A6A13  [also labelled VRAM_A13]
ULA_D0: R43.1 U7.13(D0) ; port ULA_DATA.ULA_D0
ULA_D1: R42.1 U7.14(D1) ; port ULA_DATA.ULA_D1
ULA_D2: R41.1 U7.15(D2) ; port ULA_DATA.ULA_D2
ULA_D3: R40.1 U7.17(D3) ; port ULA_DATA.ULA_D3
ULA_D4: R39.1 U7.18(D4) ; port ULA_DATA.ULA_D4
ULA_D5: R37.1 U7.19(D5) ; port ULA_DATA.ULA_D5
ULA_D6: R35.1 U7.20(D6) ; port ULA_DATA.ULA_D6
ULA_D7: R33.1 U7.21(D7) ; port ULA_DATA.ULA_D7
VRAM_A0: U7.12(A0) U9.19(1Q)
VRAM_A1: U7.11(A1) U9.18(2Q)
VRAM_A2: U7.10(A2) U9.17(3Q)
VRAM_A3: U7.9(A3) U9.16(4Q)
VRAM_A4: U7.8(A4) U9.15(5Q)
VRAM_A5: U7.7(A5) U9.14(6Q)
VRAM_A6: U7.6(A6) U9.13(7Q)
NetR25_1: R25.1 U8.1(A/B) U10.1(A/B)
NetR26_2: R26.2 U8.4(1Y)
NetR27_2: R27.2 U8.7(2Y)
NetR28_2: R28.2 U8.9(3Y)
NetR29_2: R29.2 U8.12(4Y)
NetR30_2: R30.2 U10.7(2Y)
NetR31_2: R31.2 U10.9(3Y)
NetR32_2: R32.2 U10.12(4Y)
NetR34_2: R34.2 U7.2(A16)
NetR36_2: R36.2 U7.31(A15)
NetR38_2: R38.2 U7.3(A14)

Not connected (* = marked no-connect by the designer): R25 2; U5 10(Y) 11(A); U7 22(~{CE1}) 24(~{OE}) 29(~{WE}) 30(CE2); U9 11(CLK) 12(8Q)*; U10 2(1A) 3(1B) 4(1Y)

### Notes on the sheet
- Labels drawn without touching a wire or pin: ULA_nRAS

### Library data of the parts
R25-R43 = Resistor
U5 = SN74HC04: Hex Inverters
U7 = CY62128E: 128KB Static RAM
U8 U10 = SN74HC157 Type-2: Quadruple 2-Line To 1-Line Data Selectors/Mutiplexers
U9 = SN74HC574 Type-2: Octal Edge-Triggered D-Type Flip-Flops With 3-State Outputs

## Sheet Power.SchDoc
size A3
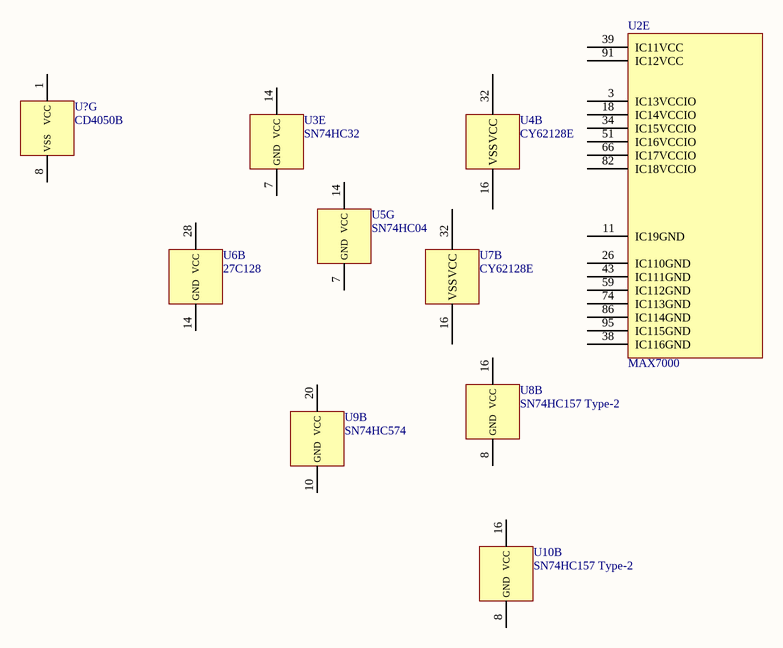
[diagram p6: Power.SchDoc]

### Parts
(Parts that share a designator on the sheet are numbered #1, #2 ... from top to bottom, then left to right.)
U2  MAX7000  [TQFP100]  (part E of 6)
U3  SN74HC32  [SOIC14]  (part E of 5)
U4  CY62128E  [CY62128E-SOIC]  (part B of 2)
U5  SN74HC04  [SOIC14]  (part G of 7)
U6  27C128  [PDIP28]  (part B of 2)
U7  CY62128E  [CY62128E-SOIC]  (part B of 2)
U8  SN74HC157 Type-2  [TSSOP16]  (part B of 2)
U9  SN74HC574  [SOIC20]  (part B of 2)
U10  SN74HC157 Type-2  [TSSOP16]  (part B of 2)
U?#1  CD4050B  [TSSOP16]  (part G of 7)

### Nets

Not connected (* = marked no-connect by the designer): U2 3(IC13VCCIO) 11(IC19GND) 18(IC14VCCIO) 26(IC110GND) 34(IC15VCCIO) 38(IC116GND) 39(IC11VCC) 43(IC111GND) 51(IC16VCCIO) 59(IC112GND) 66(IC17VCCIO) 74(IC113GND) 82(IC18VCCIO) 86(IC114GND) 91(IC12VCC) 95(IC115GND); U3 7(GND) 14(VCC); U4 16(VSS) 32(VCC); U5 7(GND) 14(VCC); U6 14(GND) 28(VCC); U7 16(VSS) 32(VCC); U8 8(GND) 16(VCC); U9 10(GND) 20(VCC); U10 8(GND) 16(VCC); U?#1 1(VCC) 8(VSS)

### Library data of the parts
U3 = SN74HC32: Quadruple 2-Input Positive-OR Gates
U4 U7 = CY62128E: 128KB Static RAM
U5 = SN74HC04: Hex Inverters
U6 = 27C128: 128K (16K x 8) CMOS EPROM
U8 U10 = SN74HC157 Type-2: as U8 on sheet VRAM
U9 = SN74HC574 Type-2: as U9 on sheet VRAM
U?#1 = CD4050B: CMOS Hex Buffers/Converters Non-Inverting Type

## Sheet VGA.SchDoc
size A3
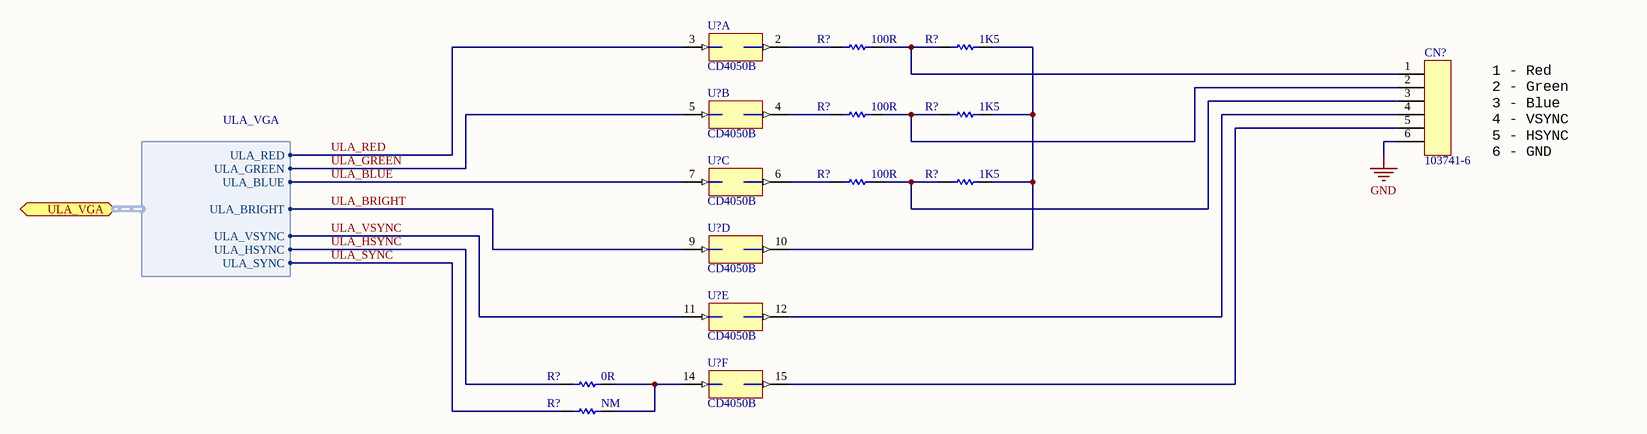
[diagram p7: VGA.SchDoc]

### Parts
(Parts that share a designator on the sheet are numbered #1, #2 ... from top to bottom, then left to right.)
CN?#2  103741-6  [103741-6]
R?#1  100R  [0805]
R?#2  1K5  [0805]
R?#3  100R  [0805]
R?#4  1K5  [0805]
R?#5  100R  [0805]
R?#6  1K5  [0805]
R?#7  0R  [0805]
R?#8  NM  [0805]
U?#2  CD4050B  [TSSOP16]  (part A of 7)
U?#3  CD4050B  [TSSOP16]  (part B of 7)
U?#4  CD4050B  [TSSOP16]  (part C of 7)
U?#5  CD4050B  [TSSOP16]  (part D of 7)
U?#6  CD4050B  [TSSOP16]  (part E of 7)
U?#7  CD4050B  [TSSOP16]  (part F of 7)

### Ports
ULA_VGA (harness ULA_VGA)

### Harnesses
ULA_VGA: ULA_BLUE, ULA_RED, ULA_GREEN, ULA_BRIGHT, ULA_HSYNC, ULA_VSYNC, ULA_SYNC

### Nets
GND: CN?#2.6
ULA_BLUE: U?#4.7(A) ; port ULA_VGA.ULA_BLUE
ULA_BRIGHT: U?#5.9(A) ; port ULA_VGA.ULA_BRIGHT
ULA_GREEN: U?#3.5(A) ; port ULA_VGA.ULA_GREEN
ULA_HSYNC: R?#7.2 ; port ULA_VGA.ULA_HSYNC
ULA_RED: U?#2.3(A) ; port ULA_VGA.ULA_RED
ULA_SYNC: R?#8.2 ; port ULA_VGA.ULA_SYNC
ULA_VSYNC: U?#6.11(A) ; port ULA_VGA.ULA_VSYNC
NetCN?#2_1: CN?#2.1 R?#1.1 R?#2.2
NetCN?#2_2: CN?#2.2 R?#3.1 R?#4.2
NetCN?#2_3: CN?#2.3 R?#5.1 R?#6.2
NetCN?#2_4: CN?#2.4 U?#6.12(Y)
NetCN?#2_5: CN?#2.5 U?#7.15(Y)
NetR?#1_2: R?#1.2 U?#2.2(Y)
NetR?#2_1: R?#2.1 R?#4.1 R?#6.1 U?#5.10(Y)
NetR?#3_2: R?#3.2 U?#3.4(Y)
NetR?#5_2: R?#5.2 U?#4.6(Y)
NetR?#7_1: R?#7.1 R?#8.1 U?#7.14(A)

### Notes on the sheet
- 1 - Red
  2 - Green
  3 - Blue
  4 - VSYNC
  5 - HSYNC
  6 - GND

### Library data of the parts
CN?#2 = 103741-6: CONN Breakaway Single Row
R?#1-R?#8 = Resistor
U?#2-U?#7 = CD4050B: as U?#1 on sheet Power

## Nets that join several sheets
5V: CPU (15 pins), ROM (U6.27 U11.27 U11.28), ULA (CN?#1.6 R22.2)
GND: CPU (C2.1 R16.1 T1.2 U1.26), RAM (R18.2 R21.2), ROM (U11.14), ULA (C4.1 C5.1 CN?#1.2 R24.1), VRAM (7 pins), VGA (CN?#2.6)
CPU_A0: CPU (U1.27), RAM (U4.12), ROM (U6.10 U11.10)
CPU_A1: CPU (U1.28), RAM (U4.11), ROM (U6.9 U11.9)
CPU_A2: CPU (U1.29), RAM (U4.10), ROM (U6.8 U11.8)
CPU_A3: CPU (U1.30), RAM (U4.9), ROM (U6.7 U11.7)
CPU_A4: CPU (U1.31), RAM (U4.8), ROM (U6.6 U11.6)
CPU_A5: CPU (U1.32), RAM (U4.7), ROM (U6.5 U11.5)
CPU_A6: CPU (U1.34), RAM (U4.6), ROM (U6.4 U11.4)
CPU_A7: CPU (U1.35), RAM (U4.5), ROM (U6.3 U11.3)
CPU_A8: CPU (U1.36), RAM (U4.27), ROM (U6.25 U11.25)
CPU_A9: CPU (U1.37), RAM (U4.26), ROM (U6.24 U11.24)
CPU_A10: CPU (U1.38), RAM (U4.23), ROM (U6.21 U11.21)
CPU_A11: CPU (U1.40), RAM (U4.25), ROM (U6.23 U11.23)
CPU_A12: CPU (U1.41), RAM (U4.4), ROM (U6.2 U11.2)
CPU_A13: CPU (U1.42), RAM (U4.28), ROM (U6.26 U11.26)
CPU_A14: CPU (U1.43), RAM (U3.2 U4.3), ROM (U3.13)
CPU_A15: CPU (U1.44), RAM (U3.1 U4.31), ROM (U3.12)
CPU_D0: CPU (R5.1 U1.9), RAM (U4.13), ROM (U6.11 U11.11)
CPU_D1: CPU (R6.1 U1.10), RAM (U4.14), ROM (U6.12 U11.12)
CPU_D2: CPU (R7.1 U1.7), RAM (U4.15), ROM (U6.13 U11.13)
CPU_D3: CPU (R8.1 U1.3), RAM (U4.17), ROM (U6.15 U11.15)
CPU_D4: CPU (R9.1 U1.2), RAM (U4.18), ROM (U6.16 U11.16)
CPU_D5: CPU (R10.1 U1.4), RAM (U4.19), ROM (U6.17 U11.17)
CPU_D6: CPU (R11.1 U1.5), RAM (U4.20), ROM (U6.18 U11.18)
CPU_D7: CPU (R12.1 U1.8), RAM (U4.21), ROM (U6.19 U11.19)
CPU_MREQ: CPU (U1.15), RAM (U3.5 U3.10), ROM (U6.22 U11.22)
CPU_RD: CPU (U1.18), RAM (U3.9)
CPU_WR: CPU (U1.19), RAM (U3.4)